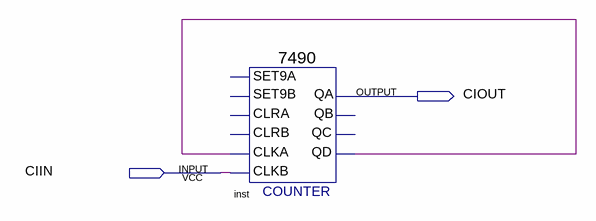
[diagram p0: schematic sheet]
// Quartus schematic 10.bdf as structural Verilog: 1 symbols, 2 pins
module \10  (
  input  CIIN,
  output CIOUT
);

  wire inst_qd;

  \7490  inst (.CLKB(CIIN), .CLKA(inst_qd), .QD(inst_qd), .QA(CIOUT));  // open: SET9A, CLRA, SET9B, CLRB, QB, QC
endmodule
